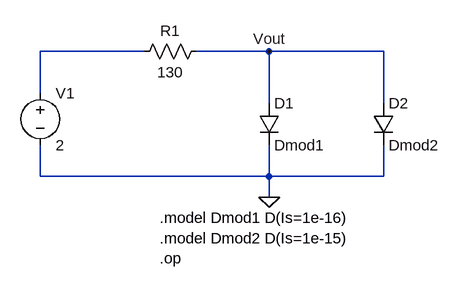
[diagram p0: schematic Draft1.asc]
Draft1.asc, the LTspice schematic file:
Version 4
SHEET 1 880 680
WIRE 224 240 64 240
WIRE 416 240 304 240
WIRE 592 240 416 240
WIRE 64 304 64 240
WIRE 416 320 416 240
WIRE 592 320 592 240
WIRE 64 432 64 384
WIRE 416 432 416 384
WIRE 416 432 64 432
WIRE 592 432 592 384
WIRE 592 432 416 432
WIRE 416 464 416 432
FLAG 416 240 Vout
FLAG 416 464 0
SYMBOL voltage 64 288 R0
SYMATTR InstName V1
SYMATTR Value 2
SYMBOL res 320 224 R90
WINDOW 0 0 56 VBottom 2
WINDOW 3 32 56 VTop 2
SYMATTR InstName R1
SYMATTR Value 130
SYMBOL diode 400 320 R0
SYMATTR InstName D1
SYMATTR Value Dmod1
SYMBOL diode 576 320 R0
SYMATTR InstName D2
SYMATTR Value Dmod2
TEXT 248 496 Left 2 !.model Dmod1 D(Is=1e-16)\n.model Dmod2 D(Is=1e-15)\n.op

The netlist it stands for:
* Draft1.asc
V1 N001 0 2
R1 Vout N001 130
D1 Vout 0 Dmod1
D2 Vout 0 Dmod2
.model D D
.lib standard.dio
.model Dmod1 D(Is=1e-16)
.model Dmod2 D(Is=1e-15)
.op
.backanno
.end